# EAGLE schematic untitled (EAGLE 8.7.1)
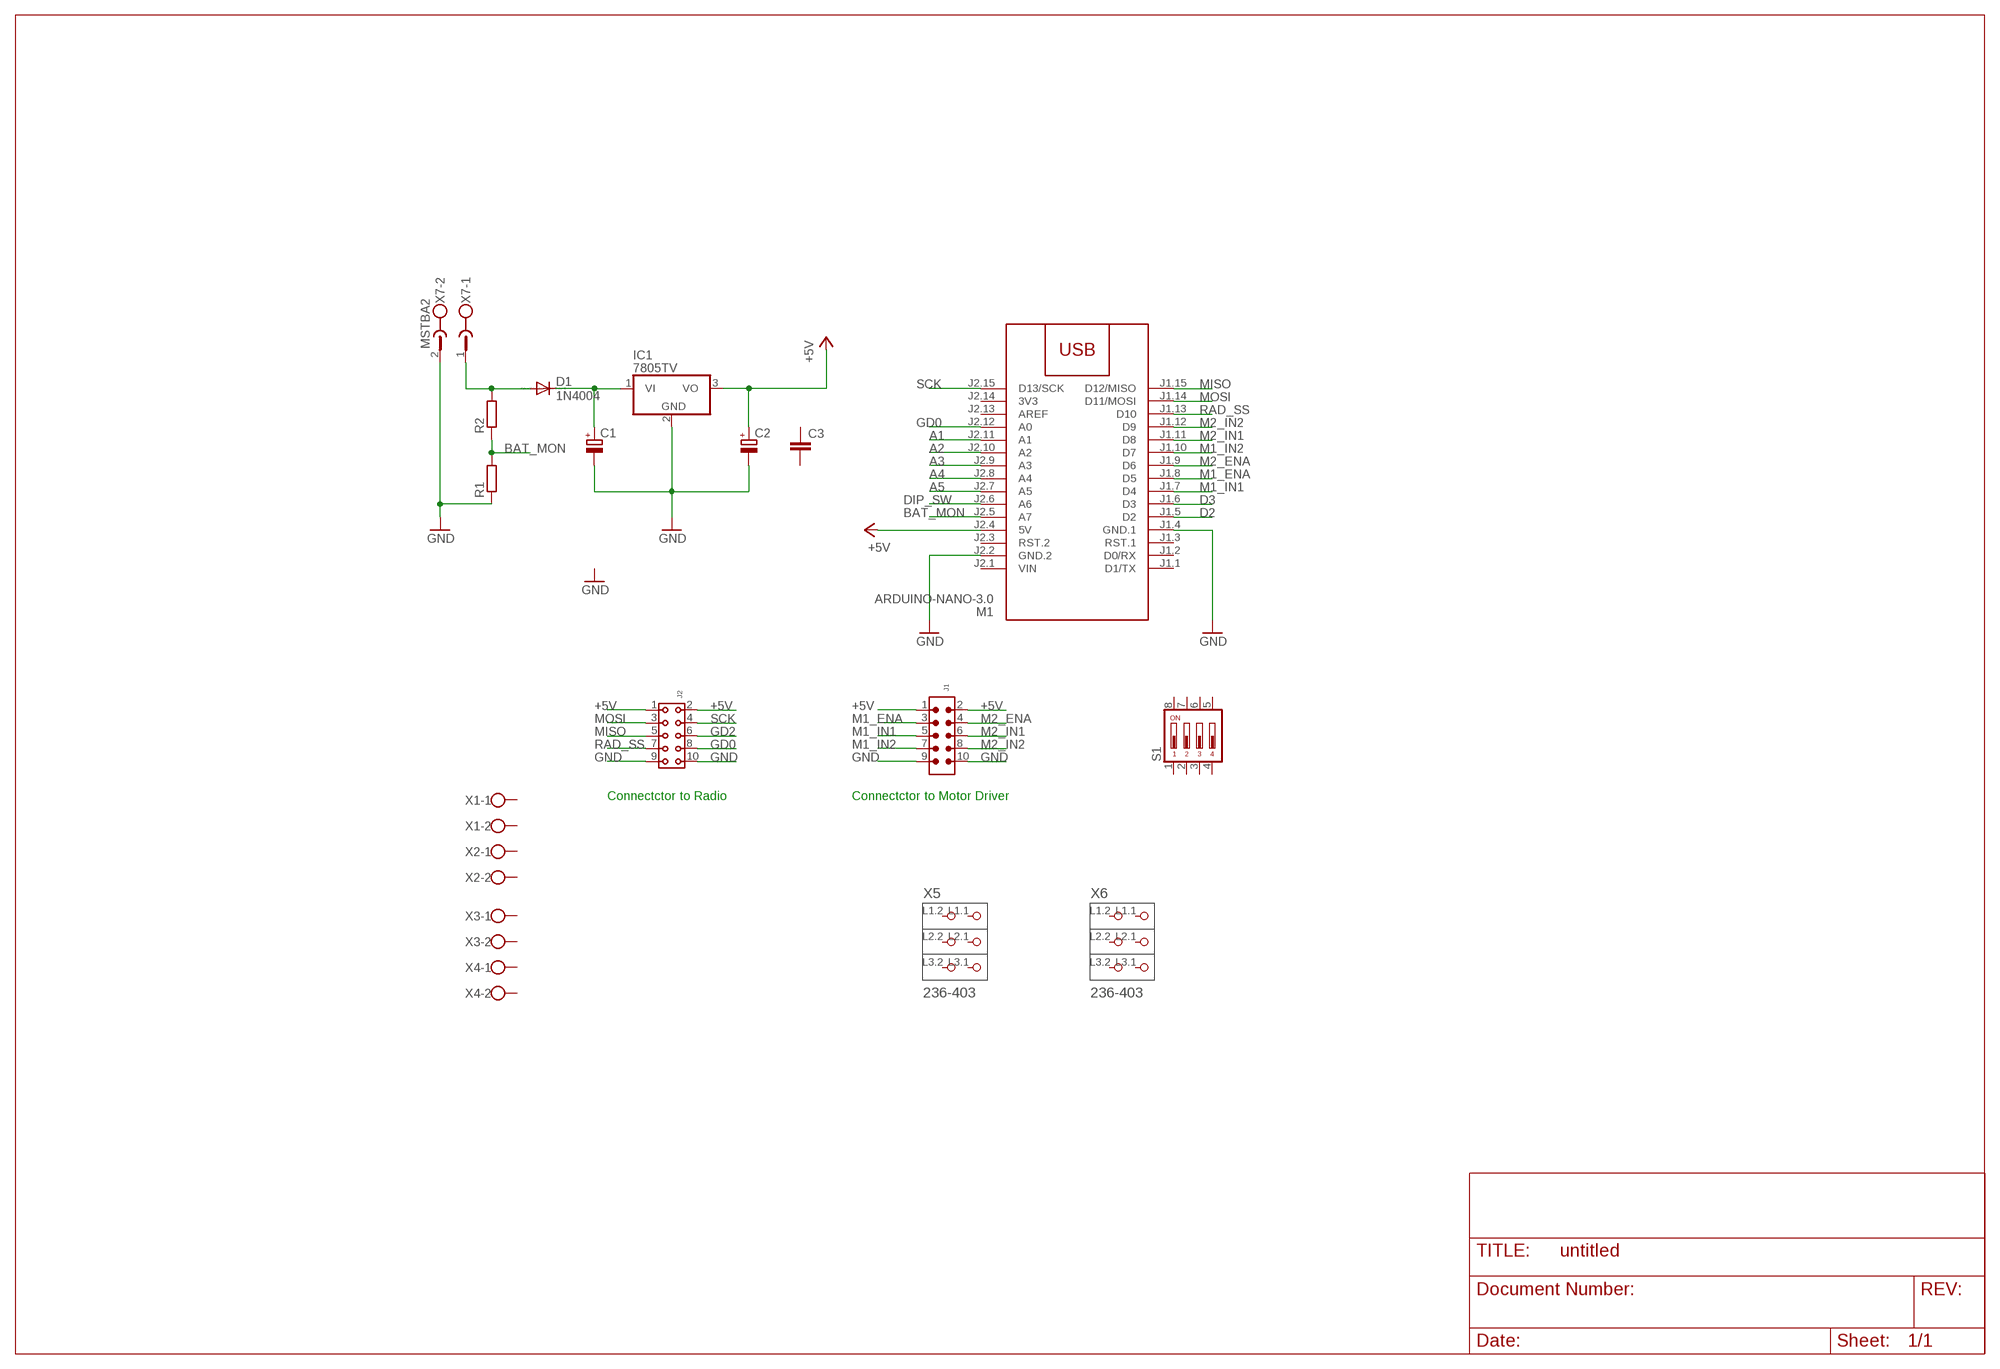
[diagram p0: schematic, sheet 1]

## Parts
C1  CPOL-EUE10-20  [EB20D]
C2  CPOL-EUE10-20  [EB20D]
C3  C-EU050-030X075  [C050-030X075]
D1  1N4004  [DO41-10]
IC1  7805TV  [TO220V]
J1  6120XX21621_61201021621  [61201021621]
J2  6130XX21821_61301021821  [61301021821]
M1  ARDUINO-NANO-3.0  [ARDUINO-NANO-3.0]
R1  R-EU_0207/7  [0207/7]
R2  R-EU_0207/7  [0207/7]
S1  DIP04YL  [DIP04YL]
X1  W237-102  [W237-102]
X2  W237-102  [W237-102]
X3  W237-102  [W237-102]
X4  W237-102  [W237-102]
X5  236-403  [P-236-403]
X6  236-403  [P-236-403]
X7  MSTBA2  [MSTBA2]

## Nets
+5V: C2.+ IC1.3(VO) J1.1 J1.2 J2.1 J2.2 M1.J2.4(5V)
A1: M1.J2.11(A1)
A2: M1.J2.10(A2)
A3: M1.J2.9(A3)
A4: M1.J2.8(A4)
A5: M1.J2.7(A5)
BAT_MON: M1.J2.5(A7) R1.2 R2.1
D2: M1.J1.5(D2)
D3: M1.J1.6(D3)
DIP_SW: M1.J2.6(A6)
GD0: J2.8 M1.J2.12(A0)
GD2: J2.6
GND: C1.- C2.- IC1.2(GND) J1.9 J1.10 J2.9 J2.10 M1.J1.4(GND.1) M1.J2.2(GND.2) R1.1 X7.2
M1_ENA: J1.3 M1.J1.8(D5)
M1_IN1: J1.5 M1.J1.7(D4)
M1_IN2: J1.7 M1.J1.10(D7)
M2_ENA: J1.4 M1.J1.9(D6)
M2_IN1: J1.6 M1.J1.11(D8)
M2_IN2: J1.8 M1.J1.12(D9)
MISO: J2.5 M1.J1.15(D12/MISO)
MOSI: J2.3 M1.J1.14(D11/MOSI)
N$1: D1.A R2.2 X7.1
N$3: C1.+ D1.C IC1.1(VI)
RAD_SS: J2.7 M1.J1.13(D10)
SCK: J2.4 M1.J2.15(D13/SCK)
Unconnected: C3.1 C3.2 M1.J1.1(D1/TX) M1.J1.2(D0/RX) M1.J1.3(RST.1) M1.J2.3(RST.2) M1.J2.13(AREF) S1.1 S1.2 S1.3 S1.4 S1.5 S1.6 S1.7 S1.8 X1.1 X1.2 X2.1 X2.2 X3.1 X3.2 X4.1 X4.2 X5.L1.1(P1.1) X5.L1.2(P1.2) X5.L2.1(P2.1) X5.L2.2(P2.2) X5.L3.1(P3.1) X5.L3.2(P3.2) X6.L1.1(P1.1) X6.L1.2(P1.2) X6.L2.1(P2.1) X6.L2.2(P2.2) X6.L3.1(P3.1) X6.L3.2(P3.2)

## Notes on the sheet
- Connectctor to Radio | Connectctor to Motor Driver

## Power pins joined to a net without a drawn wire
3V3: M1.J2.14(3V3)
VIN: M1.J2.1(VIN)

## Library data of the parts
C1 C2 = resistor:CPOL-EU: POLARIZED CAPACITOR, European symbol
C3 = rcl:C-EU: CAPACITOR, European symbol; SPICEPREFIX: C
D1 = diode:1N4004: DIODE general purpose rectifier, 1 A
IC1 = linear:78*: Positive VOLTAGE REGULATOR Source: http://cache.national.com/ds/LM/LM78L05.pdf http://www.fairchildsemi.com/ds/LM/LM7805.pdf
J1 = Wurth_Connectors_WR-BHD:6120XX21621_61201021621: WR-BHD 2.54 mm Male Box Header KIND PROPERTIES: Pitch 2.54 mm Gender:Male MATERIAL PROPERTIES: Insulator Material:PBT Insulator Flammability Rating UL94 V-0 Insulator Color:Black Contact Material :Copper Alloy Contact Plating :Gold Contact Type: Stamped GENERAL INFORMATION: Operating Temperature:-40 °C up to +125 °C Compliance:RoHS Working Voltage: 250 V (AC) Withstanding Voltage:500 V (AC) Contact Resistance: 20 mΩ Insulation Resistance:1000 MΩ CERTIFICATION: UL Approval:E323964 PACKAGING PROPERTIES Packaging :Tray <https://katalog.we-online.com/media/images/v2/o32884v209%20Family_WR-BHD_6120xx21621.jpg> Details see: https://katalog.we-online.com/en/em/BHD_2_54_MALE_BOX_HEADER_6120XX21621 Updated by Yingchun,Shan 2019-10-29 2019 (C) Würth Elektronik; CONTACT-RESISTANCE: 20mOhm; DATASHEET-URL: https://katalog.we-online.com/em/datasheet/61201021621.pdf; GENDER: Male; IR: 3A; L: 20.36mm; MATES: WR-BHD 2.54mm Female IDC Connector with Strain Relief; MOUNT: THT; PACKAGING: Tray; PART-NUMBER: 61201021621; PINS: 10; PITCH: 2.54mm; TOL-R: max.; TYPE: Straight; WORKING-VOLTAGE: 250V(AC)
J2 = Wurth_Connectors_WR-PHD:6130XX21821_61301021821: WR-PHD 2.54 mm Dual Socket Header ARTICLE PROPERTIES: Pins:4;​ 6;​ 8;​ 10;​ 12;​ 14;​ 16;​ 18;​ 20;​ 22;​ 24;​ 26;​ 28;​ 30;​ 32;​ 34;​ 36;​ 40;​ 44;​ 64;​ 72 KIND PROPERTIES: Pitch：2.54 mm Quality Class:3 as per CECC 75 301-802 Rows：Dual Gender：Socket Header Type：Straight MATERIAL PROPERTIES: Insulator Material :PBT Insulator Flammability Rating:UL94 V-0 Contact Material:Copper Alloy Contact Plating:Gold Contact Type:Stamped GENERAL INFORMATION Operating Temperature:-40 up to +125 °C Compliance:Lead free / RoHS ELECTRICAL PROPERTIES: Rated Current:3 A IR 1:3 A Withstanding Voltage:500 V (AC) Contact Resistance:20 mΩ RISO:1000 MΩ CERTIFICATION UL Approval:E323964 PACKAGING PROPERTIES Packaging:Tray <https://katalog.we-online.com/media/images/v2/o57948v209%20Family_Dual_Socket_Header_WR-PHD_6130xx21821.jpg> Details see: https://katalog.we-online.com/en/em/PHD_2_54_DUAL_SOCKET_HEADER_6130XX21821 Updated by Yingchun,Shan 2019-10-21 2019 (C) Würth Elektronik; DATASHEET-URL: https://katalog.we-online.com/em/datasheet/61301021821.pdf; GENDER: Socket Header; IR: 3A; MATES: WR-PHD 2.54mm SMT Dual Pin Header/THT Angled Dual Pin Header/THT Dual Board Stacker/THT Dual Pin Header; PACKAGING: Tray; PART-NUMBER: 61301021821; PINS: 10; ROWS: Dual; TYPE: Straight
M1 = diy-modules:ARDUINO-NANO-3.0: Arduino Nano 3.0 and compatible devices More details available here: https://www.arduino.cc/en/Main/ArduinoBoardNano Click here to find device on ebay.com <http://www.ebay.com/sch/arduino+nano>
R1 R2 = resistor:R-EU_: RESISTOR, European symbol
S1 = switch-dil:DIP04YL: DIL/CODE SWITCH; OC_FARNELL: unknown; OC_NEWARK: unknown
X1-X4 = con-wago-500:W237-102: WAGO SCREW CLAMP; MPN: 237-102; OC_FARNELL: unknown; OC_NEWARK: 70K9898
X5 X6 = con-wago_236:236-403: Serie 236, Klemmenleiste für Leiterplatten 2 Lötstifte/Pol / Series 236, PCB terminal strip 2 solder pins/pole Polzahl / Pole No.: 3 Rastermaß / Pitch: 5.08 mm Bemessungsspannung / Rated Voltage: 320 V Nennstrom / Nominal Current: 24 A Leiterquerschnitt / Conductor Size: 0.08 - 2.5 mm² Anschlusstechnik / Connection Technology: CAGE CLAMP® Lötstiftlänge: / Solder Pin Length: 4 mm Leitereinführung (zur Platine) / Conductor entry angle (to PCB): 45 ° Farbe / Color: grau / gray Stand: 01.01.2012. Die jeweils aktuellen Daten zu diesem Artikel finden Sie in unserem Produktkatalog, den Sie unter www.wago.com einsehen können. As of: 01/01/2012. Please find the newest data for this article in our product catalogue, which can be viewed under www.wago.com.
X7 = con-phoenix-508:MSTBA2: PHOENIX; MF: FARNELL; MPN: 1757242; OC_FARNELL: 3705171; OC_NEWARK: 71C4161